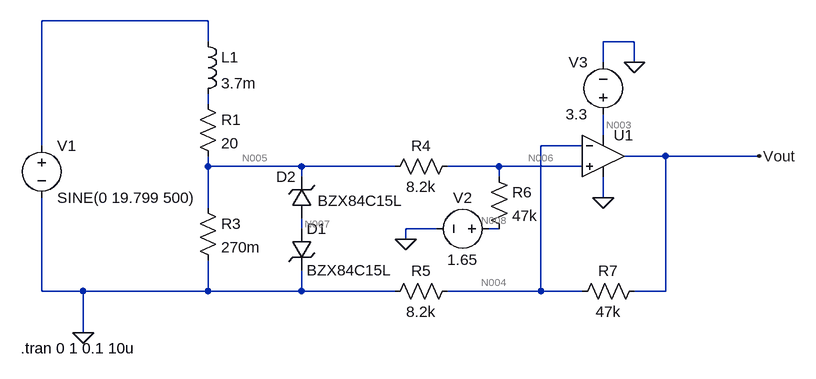
[diagram p0: schematic Lab2Task5.asc]
Lab2Task5.asc, the LTspice schematic file:
Version 4
SHEET 1 880 680
WIRE -624 -336 -880 -336
WIRE -624 -304 -624 -336
WIRE 32 -304 -16 -304
WIRE -16 -272 -16 -304
WIRE 32 -272 32 -304
WIRE -624 -208 -624 -224
WIRE -16 -160 -16 -192
WIRE -880 -144 -880 -336
WIRE -48 -144 -112 -144
WIRE 80 -128 16 -128
WIRE 224 -128 80 -128
WIRE -624 -112 -624 -128
WIRE -480 -112 -624 -112
WIRE -336 -112 -480 -112
WIRE -176 -112 -256 -112
WIRE -48 -112 -176 -112
WIRE -480 -96 -480 -112
WIRE -176 -96 -176 -112
WIRE -16 -64 -16 -96
WIRE -624 -48 -624 -112
WIRE -480 -16 -480 -32
WIRE -272 -16 -320 -16
WIRE -176 -16 -192 -16
WIRE -320 0 -320 -16
WIRE -880 80 -880 -64
WIRE -816 80 -880 80
WIRE -624 80 -624 32
WIRE -624 80 -816 80
WIRE -480 80 -480 48
WIRE -480 80 -624 80
WIRE -336 80 -480 80
WIRE -112 80 -112 -144
WIRE -112 80 -256 80
WIRE -48 80 -112 80
WIRE 80 80 80 -128
WIRE 80 80 32 80
WIRE -816 144 -816 80
FLAG -816 144 0
FLAG -320 0 0
FLAG 32 -272 0
FLAG -16 -64 0
FLAG 224 -128 Vout
SYMBOL voltage -880 -160 R0
WINDOW 123 0 0 Left 2
WINDOW 39 0 0 Left 2
SYMATTR InstName V1
SYMATTR Value SINE(0 19.799 500)
SYMBOL ind -640 -320 R0
SYMATTR InstName L1
SYMATTR Value 3.7m
SYMBOL res -640 -224 R0
SYMATTR InstName R1
SYMATTR Value 20
SYMBOL zener -496 -16 R0
SYMATTR InstName D1
SYMATTR Value BZX84C15L
SYMATTR Description Diode
SYMATTR Type diode
SYMBOL zener -464 -32 R180
WINDOW 0 24 64 Left 2
WINDOW 3 -140 27 Left 2
SYMATTR InstName D2
SYMATTR Value BZX84C15L
SYMATTR Description Diode
SYMATTR Type diode
SYMBOL res -240 -128 R90
WINDOW 0 0 56 VBottom 2
WINDOW 3 32 56 VTop 2
SYMATTR InstName R4
SYMATTR Value 8.2k
SYMBOL res -240 64 R90
WINDOW 0 0 56 VBottom 2
WINDOW 3 32 56 VTop 2
SYMATTR InstName R5
SYMATTR Value 8.2k
SYMBOL res -192 -112 R0
SYMATTR InstName R6
SYMATTR Value 47k
SYMBOL Opamps\\UniversalOpamp2 -16 -128 R0
SYMATTR InstName U1
SYMBOL voltage -176 -16 R90
WINDOW 0 -32 56 VBottom 2
WINDOW 3 32 56 VTop 2
SYMATTR InstName V2
SYMATTR Value 1.65
SYMBOL voltage -16 -176 R180
WINDOW 0 24 96 Left 2
WINDOW 3 24 16 Left 2
SYMATTR InstName V3
SYMATTR Value 3.3
SYMBOL res 48 64 R90
WINDOW 0 0 56 VBottom 2
WINDOW 3 32 56 VTop 2
SYMATTR InstName R7
SYMATTR Value 47k
SYMBOL res -640 -64 R0
SYMATTR InstName R3
SYMATTR Value 270m
TEXT -912 168 Left 2 !.tran 0 1 0.1 10u

The netlist it stands for:
* Lab2Task5.asc
V1 N001 0 SINE(0 19.799 500)
L1 N001 N002 3.7m
R1 N002 N005 20
D1 N007 0 BZX84C15L
D2 N007 N005 BZX84C15L
R4 N006 N005 8.2k
R5 N004 0 8.2k
R6 N006 N008 47k
XU1 N006 N004 N003 0 Vout level.2 Avol=1Meg GBW=10Meg Slew=10Meg ilimit=25m rail=0 Vos=0 phimargin=45 en=0 enk=0 in=0 ink=0 Rin=500Meg  ; pins IN+ IN- V+ V- OUT
V2 N008 0 1.65
V3 N003 0 3.3
R7 Vout N004 47k
R3 N005 0 270m
.model D D
.lib standard.dio
.tran 0 1 0.1 10u
.lib UniversalOpamps2.sub
.backanno
.end

* Results of the author's LTspice run, read from the files saved beside the schematic
* Operating Point, zero values left out:
*   V(n005) = 7.964 µV
*   V(n007) = 3.982 µV
*   V(n006) = 245.1 mV
*   V(n004) = 245.1 mV
*   V(n008) = 1.65 V
*   V(vout) = 1.65 V
*   V(n003) = 3.3 V
*   I(L1) = -398.2 nA
*   I(R3) = 29.5 µA
*   I(R7) = 29.89 µA
*   I(R6) = -29.89 µA
*   I(R5) = 29.89 µA
*   I(R4) = 29.89 µA
*   I(R1) = -398.2 nA
*   I(V3) = -180.6 µA
*   I(V2) = -29.89 µA
*   I(V1) = 398.2 nA
*   Ix(u1:1) = -2.81 nA
*   Ix(u1:2) = -2.81 nA
*   Ix(u1:3) = 180.6 µA
*   Ix(u1:4) = -150.7 µA
*   Ix(u1:5) = -29.89 µA
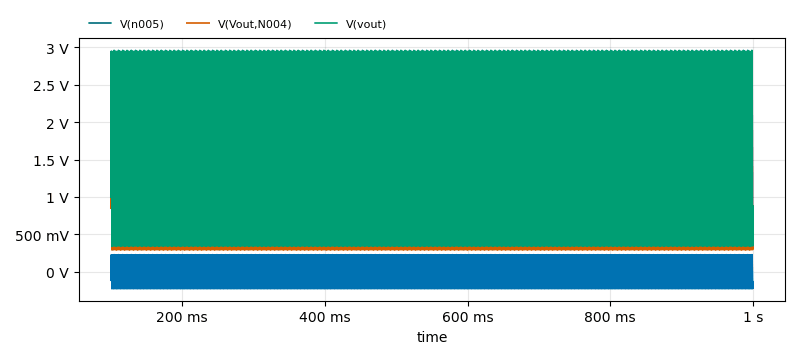
[diagram p1: Transient Analysis of Lab2Task5.asc, plotted from the saved traces]
* Transient Analysis, 1 run:
*   V(n005): min -228.6 mV, max 228.6 mV, average 98.8 µV, rms 161.9 mV, last -113.8 mV
*   V(Vout,N004): min 289.2 mV, max 2.521 V, average 1.405 V, rms 1.612 V, last 849.2 mV
*   V(vout): min 339.7 mV, max 2.96 V, average 1.651 V, rms 1.893 V, last 997.4 mV